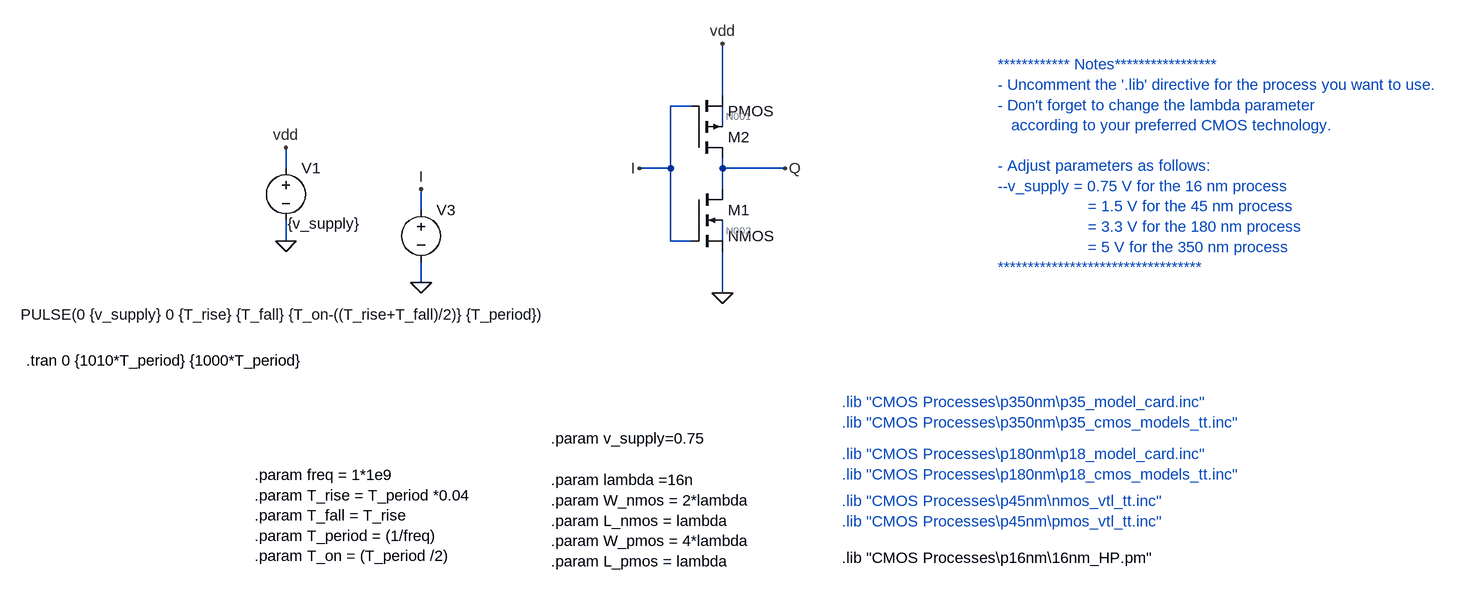
[diagram p0: schematic CMOS_inv.asc]
CMOS_inv.asc, the LTspice schematic file:
Version 4
SHEET 1 880 1120
WIRE -336 224 -336 144
WIRE -384 240 -416 240
WIRE -336 272 -336 240
WIRE -1008 336 -1008 304
WIRE -416 336 -416 240
WIRE -416 336 -464 336
WIRE -336 336 -336 320
WIRE -240 336 -336 336
WIRE -336 368 -336 336
WIRE -800 400 -800 368
WIRE -1008 448 -1008 416
WIRE -416 448 -416 336
WIRE -384 448 -416 448
WIRE -336 448 -336 416
WIRE -800 512 -800 480
WIRE -336 528 -336 464
FLAG -336 144 vdd
FLAG -336 528 0
FLAG -1008 448 0
FLAG -800 512 0
FLAG -1008 304 vdd
FLAG -800 368 I
FLAG -464 336 I
FLAG -240 336 Q
SYMBOL nmos4 -384 368 R0
SYMATTR InstName M1
SYMATTR Value2 l=L_nmos w=W_nmos
SYMBOL voltage -1008 320 R0
WINDOW 3 3 101 Left 2
WINDOW 123 0 0 Left 0
WINDOW 39 0 0 Left 0
SYMATTR Value {v_supply}
SYMATTR InstName V1
SYMBOL voltage -800 384 R0
WINDOW 3 -616 177 Left 2
WINDOW 123 0 0 Left 0
WINDOW 39 0 0 Left 0
SYMATTR Value PULSE(0 {v_supply} 0 {T_rise} {T_fall} {T_on-((T_rise+T_fall)/2)} {T_period})
SYMATTR InstName V3
SYMBOL pmos4 -384 320 M180
SYMATTR InstName M2
SYMATTR Value2 l=L_pmos  w=W_pmos
TEXT -600 752 Left 2 !.param v_supply=0.75
TEXT -1056 808 Left 2 !.param freq = 1*1e9\n.param T_rise = T_period *0.04\n.param T_fall = T_rise \n.param T_period = (1/freq)\n.param T_on = (T_period /2)
TEXT -600 816 Left 2 !.param lambda =16n\n.param W_nmos = 2*lambda\n.param L_nmos = lambda\n.param W_pmos = 4*lambda\n.param L_pmos = lambda
TEXT -1408 632 Left 2 !.tran 0 {1010*T_period} {1000*T_period}
TEXT -152 696 Left 2 ;.lib "CMOS Processes\\p350nm\\p35_model_card.inc"\n.lib "CMOS Processes\\p350nm\\p35_cmos_models_tt.inc"
TEXT -152 776 Left 2 ;.lib "CMOS Processes\\p180nm\\p18_model_card.inc"\n.lib "CMOS Processes\\p180nm\\p18_cmos_models_tt.inc"
TEXT -152 848 Left 2 ;.lib "CMOS Processes\\p45nm\\nmos_vtl_tt.inc"\n.lib "CMOS Processes\\p45nm\\pmos_vtl_tt.inc"
TEXT -152 936 Left 2 !.lib "CMOS Processes\\p16nm\\16nm_HP.pm"
TEXT 88 176 Left 2 ;************ Notes*****************\n- Uncomment the '.lib' directive for the process you want to use.\n- Don't forget to change the lambda parameter \n   according to your preferred CMOS technology.\n \n- Adjust parameters as follows:\n--v_supply = 0.75 V for the 16 nm process\n                    = 1.5 V for the 45 nm process\n                    = 3.3 V for the 180 nm process\n                    = 5 V for the 350 nm process\n**********************************

The netlist it stands for:
* CMOS_inv.asc
M1 Q I 0 N002 NMOS l=L_nmos w=W_nmos
V1 vdd 0 {v_supply}
V3 I 0 PULSE(0 {v_supply} 0 {T_rise} {T_fall} {T_on-((T_rise+T_fall)/2)} {T_period})
M2 Q I vdd N001 PMOS l=L_pmos  w=W_pmos
.model NMOS NMOS
.model PMOS PMOS
.lib standard.mos
.param v_supply=0.75
.param freq = 1*1e9
.param T_rise = T_period *0.04
.param T_fall = T_rise
.param T_period = (1/freq)
.param T_on = (T_period /2)
.param lambda =16n
.param W_nmos = 2*lambda
.param L_nmos = lambda
.param W_pmos = 4*lambda
.param L_pmos = lambda
.tran 0 {1010*T_period} {1000*T_period}
* .lib "CMOS Processes\p350nm\p35_model_card.inc"
* .lib "CMOS Processes\p350nm\p35_cmos_models_tt.inc"
* .lib "CMOS Processes\p180nm\p18_model_card.inc"
* .lib "CMOS Processes\p180nm\p18_cmos_models_tt.inc"
* .lib "CMOS Processes\p45nm\nmos_vtl_tt.inc"
* .lib "CMOS Processes\p45nm\pmos_vtl_tt.inc"
.lib "CMOS Processes\p16nm\16nm_HP.pm"
* ************ Notes*****************
* - Uncomment the '.lib' directive for the process you want to use.
* - Don't forget to change the lambda parameter
*    according to your preferred CMOS technology.
* - Adjust parameters as follows:
* --v_supply = 0.75 V for the 16 nm process
*                     = 1.5 V for the 45 nm process
*                     = 3.3 V for the 180 nm process
*                     = 5 V for the 350 nm process
* **********************************
.backanno
.end

* Results of the author's LTspice run, read from the files saved beside the schematic
* Operating Point, zero values left out:
*   V(q) = 749.5 mV
*   V(n002) = 240.5 mV
*   V(vdd) = 750 mV
*   V(n001) = 620.8 mV
*   Id(M2) = -62.49 nA
*   Ig(M2) = -1.084 pA
*   Is(M2) = 62.49 nA
*   Id(M1) = 62.49 nA
*   Ig(M1) = -17.39 pA
*   Is(M1) = -62.48 nA
*   I(V3) = 18.48 pA
*   I(V1) = -62.49 nA
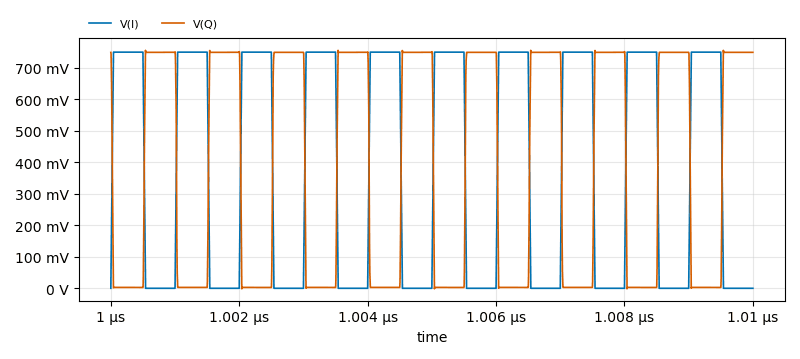
[diagram p1: Transient Analysis of CMOS_inv.asc, plotted from the saved traces]
* Transient Analysis, 1 run:
*   V(I): min 0 V, max 750 mV, average 375 mV, rms 523.7 mV, last 0 V
*   V(Q): min -1.62 mV, max 755.6 mV, average 378.1 mV, rms 526.4 mV, last 749.3 mV